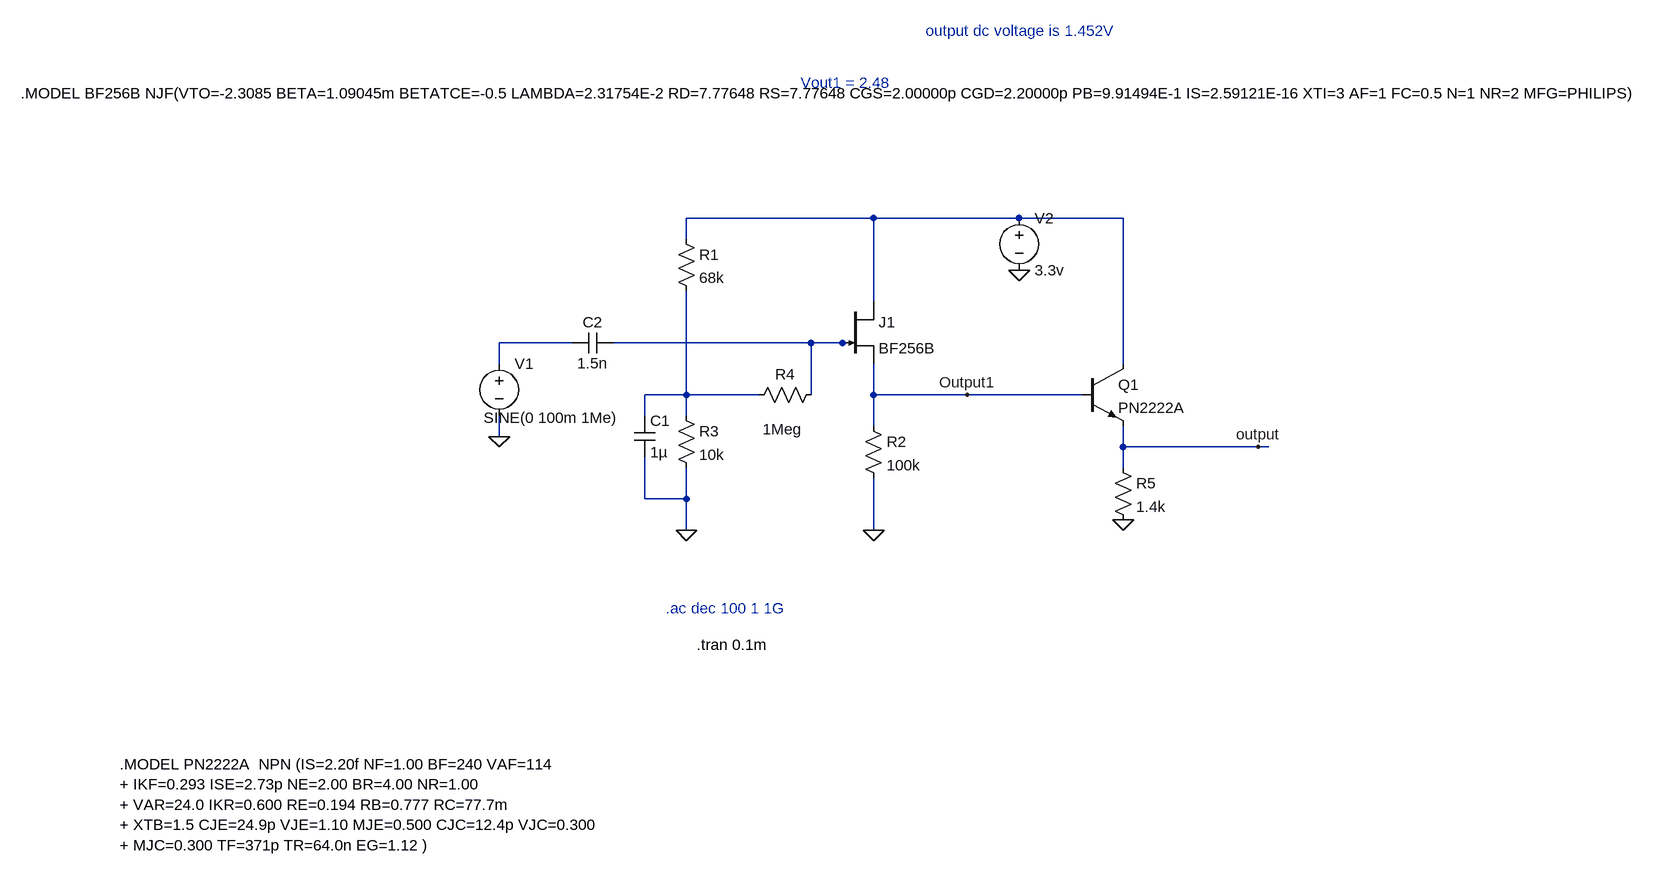
[diagram p0: schematic Modified Active Antenna.asc]
Modified Active Antenna.asc, the LTspice schematic file:
Version 4
SHEET 1 2276 1232
WIRE 816 288 528 288
WIRE 1040 288 816 288
WIRE 1200 288 1040 288
WIRE 528 320 528 288
WIRE 816 416 816 288
WIRE 352 480 240 480
WIRE 720 480 416 480
WIRE 768 480 720 480
WIRE 784 480 768 480
WIRE 240 512 240 480
WIRE 1200 512 1200 288
WIRE 528 560 528 400
WIRE 528 560 464 560
WIRE 640 560 528 560
WIRE 720 560 720 480
WIRE 816 560 816 512
WIRE 960 560 816 560
WIRE 1136 560 960 560
WIRE 464 592 464 560
WIRE 528 592 528 560
WIRE 816 608 816 560
WIRE 240 624 240 592
WIRE 1200 640 1200 608
WIRE 1408 640 1200 640
WIRE 1424 640 1408 640
WIRE 1200 672 1200 640
WIRE 464 720 464 656
WIRE 528 720 528 672
WIRE 528 720 464 720
WIRE 528 768 528 720
WIRE 816 768 816 688
FLAG 240 624 0
FLAG 816 768 0
FLAG 960 560 Output1
FLAG 1040 368 0
FLAG 528 768 0
FLAG 1200 752 0
FLAG 1408 640 output
DATAFLAG 816 560 "$"
DATAFLAG 1088 560 "$"
SYMBOL njf 768 416 R0
SYMATTR InstName J1
SYMATTR Value BF256B
SYMBOL voltage 240 496 R0
WINDOW 3 183 99 Right 2
SYMATTR Value SINE(0 100m 1Me)
SYMATTR InstName V1
SYMATTR Value2 AC 1
SYMBOL res 800 592 R0
SYMATTR InstName R2
SYMATTR Value 100k
SYMBOL voltage 1040 272 R0
SYMATTR InstName V2
SYMATTR Value 3.3v
SYMBOL res 512 304 R0
SYMATTR InstName R1
SYMATTR Value 68k
SYMBOL res 512 576 R0
SYMATTR InstName R3
SYMATTR Value 10k
SYMBOL cap 416 464 R90
WINDOW 0 0 32 VBottom 2
WINDOW 3 32 32 VTop 2
SYMATTR InstName C2
SYMATTR Value 1.5n
SYMBOL res 736 544 R90
WINDOW 0 0 56 VBottom 2
WINDOW 3 53 60 VTop 2
SYMATTR InstName R4
SYMATTR Value 1Meg
SYMBOL npn 1136 512 R0
SYMATTR InstName Q1
SYMATTR Value PN2222A
SYMBOL res 1184 656 R0
SYMATTR InstName R5
SYMATTR Value 1.4k
SYMBOL cap 448 592 R0
SYMATTR InstName C1
SYMATTR Value 1µ
TEXT -496 96 Left 2 !.MODEL BF256B NJF(VTO=-2.3085 BETA=1.09045m BETATCE=-0.5 LAMBDA=2.31754E-2 RD=7.77648 RS=7.77648 CGS=2.00000p CGD=2.20000p PB=9.91494E-1 IS=2.59121E-16 XTI=3 AF=1 FC=0.5 N=1 NR=2 MFG=PHILIPS)
TEXT 496 888 Left 2 ;.ac dec 100 1 1G
TEXT 896 0 Left 2 ;output dc voltage is 1.452V
TEXT 704 80 Left 2 ;Vout1 = 2.48
TEXT -344 1128 Left 2 !.MODEL PN2222A  NPN (IS=2.20f NF=1.00 BF=240 VAF=114\n+ IKF=0.293 ISE=2.73p NE=2.00 BR=4.00 NR=1.00\n+ VAR=24.0 IKR=0.600 RE=0.194 RB=0.777 RC=77.7m\n+ XTB=1.5 CJE=24.9p VJE=1.10 MJE=0.500 CJC=12.4p VJC=0.300\n+ MJC=0.300 TF=371p TR=64.0n EG=1.12 )
TEXT 544 944 Left 2 !.tran 0.1m

The netlist it stands for:
* Modified Active Antenna.asc
J1 N001 N003 Output1 BF256B
V1 N002 0 SINE(0 100m 1Me) AC 1
R2 Output1 0 100k
V2 N001 0 3.3v
R1 N001 N004 68k
R3 N004 0 10k
C2 N003 N002 1.5n
R4 N003 N004 1Meg
Q1 N001 Output1 output 0 PN2222A
R5 output 0 1.4k
C1 N004 0 1µ
.model NPN NPN
.model PNP PNP
.lib standard.bjt
.model NJF NJF
.model PJF PJF
.lib standard.jft
.MODEL BF256B NJF(VTO=-2.3085 BETA=1.09045m BETATCE=-0.5 LAMBDA=2.31754E-2 RD=7.77648 RS=7.77648 CGS=2.00000p CGD=2.20000p PB=9.91494E-1 IS=2.59121E-16 XTI=3 AF=1 FC=0.5 N=1 NR=2 MFG=PHILIPS)
* .ac dec 100 1 1G
* output dc voltage is 1.452V
* Vout1 = 2.48
.MODEL PN2222A  NPN (IS=2.20f NF=1.00 BF=240 VAF=114
+ IKF=0.293 ISE=2.73p NE=2.00 BR=4.00 NR=1.00
+ VAR=24.0 IKR=0.600 RE=0.194 RB=0.777 RC=77.7m
+ XTB=1.5 CJE=24.9p VJE=1.10 MJE=0.500 CJC=12.4p VJC=0.300
+ MJC=0.300 TF=371p TR=64.0n EG=1.12 )
.tran 0.1m
.backanno
.end